# Altium schematic sheet Mosfet Driver.SchDoc
size A4; SheetNumber: 1; SheetTotal: 3
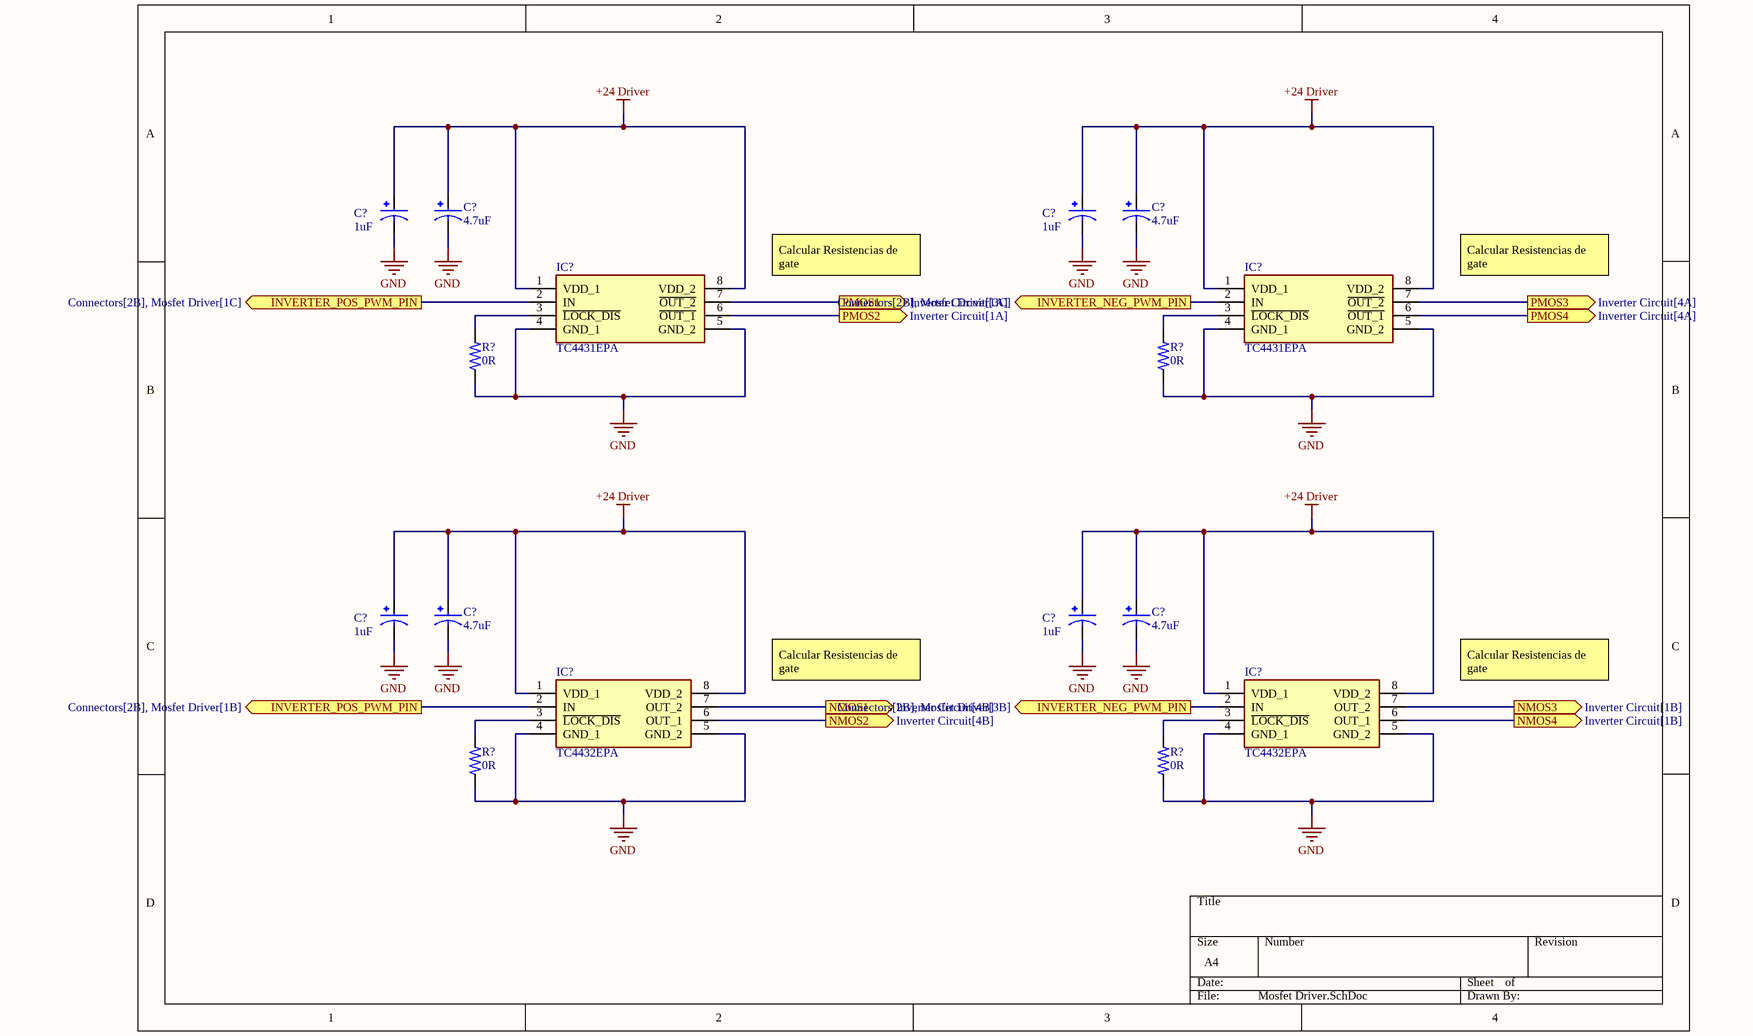
[diagram p0: Mosfet Driver.SchDoc]

## Parts
(Parts that share a designator on the sheet are numbered #1, #2 ... from top to bottom, then left to right.)
C?#1  1uF  [Electrolytic 4x5.4]
C?#2  4.7uF  [Electrolytic 4x5.4]
C?#3  1uF  [Electrolytic 4x5.4]
C?#4  4.7uF  [Electrolytic 4x5.4]
C?#5  1uF  [Electrolytic 4x5.4]
C?#6  4.7uF  [Electrolytic 4x5.4]
C?#7  1uF  [Electrolytic 4x5.4]
C?#8  4.7uF  [Electrolytic 4x5.4]
IC?#1  TC4431EPA  [DIP781W56P254L950H533Q8N]
IC?#2  TC4431EPA  [DIP781W56P254L950H533Q8N]
IC?#3  TC4432EPA  [DIP781W56P254L950H533Q8N]
IC?#4  TC4432EPA  [DIP781W56P254L950H533Q8N]
R?#1  0R  [0805]
R?#2  0R  [0805]
R?#3  0R  [0805]
R?#4  0R  [0805]

## Ports
INVERTER_NEG_PWM_PIN (out, see Connectors[2B], Mosfet Driver[3B]), INVERTER_NEG_PWM_PIN (out, see Connectors[2B], Mosfet Driver[3C]), INVERTER_POS_PWM_PIN (out, see Connectors[2B], Mosfet Driver[1B]), INVERTER_POS_PWM_PIN (out, see Connectors[2B], Mosfet Driver[1C]), NMOS1 (out, see Inverter Circuit[4B]), NMOS2 (out, see Inverter Circuit[4B]), NMOS3 (out, see Inverter Circuit[1B]), NMOS4 (out, see Inverter Circuit[1B]), PMOS1 (out, see Inverter Circuit[1A]), PMOS2 (out, see Inverter Circuit[1A]), PMOS3 (out, see Inverter Circuit[4A]), PMOS4 (out, see Inverter Circuit[4A])

## Nets
+24 Driver: C?#1.1 C?#2.1 C?#3.1 C?#4.1 C?#5.1 C?#6.1 C?#7.1 C?#8.1 IC?#1.1(VDD_1) IC?#1.8(VDD_2) IC?#2.1(VDD_1) IC?#2.8(VDD_2) IC?#3.1(VDD_1) IC?#3.8(VDD_2) IC?#4.1(VDD_1) IC?#4.8(VDD_2)
GND: C?#1.2 C?#2.2 C?#3.2 C?#4.2 C?#5.2 C?#6.2 C?#7.2 C?#8.2 IC?#1.4(GND_1) IC?#1.5(GND_2) IC?#2.4(GND_1) IC?#2.5(GND_2) IC?#3.4(GND_1) IC?#3.5(GND_2) IC?#4.4(GND_1) IC?#4.5(GND_2) R?#1.1 R?#2.1 R?#3.1 R?#4.1
INVERTER_NEG_PWM_PIN: IC?#2.2(IN) IC?#4.2(IN) ; port INVERTER_NEG_PWM_PIN
INVERTER_POS_PWM_PIN: IC?#1.2(IN) IC?#3.2(IN) ; port INVERTER_POS_PWM_PIN
NMOS1: IC?#3.7(OUT_2) ; port NMOS1
NMOS2: IC?#3.6(OUT_1) ; port NMOS2
NMOS3: IC?#4.7(OUT_2) ; port NMOS3
NMOS4: IC?#4.6(OUT_1) ; port NMOS4
PMOS1: IC?#1.7(~{OUT_2}) ; port PMOS1
PMOS2: IC?#1.6(~{OUT_1}) ; port PMOS2
PMOS3: IC?#2.7(~{OUT_2}) ; port PMOS3
PMOS4: IC?#2.6(~{OUT_1}) ; port PMOS4
NetIC?#1_3: IC?#1.3(~{LOCK_DIS}) R?#1.2
NetIC?#2_3: IC?#2.3(~{LOCK_DIS}) R?#2.2
NetIC?#3_3: IC?#3.3(~{LOCK_DIS}) R?#3.2
NetIC?#4_3: IC?#4.3(~{LOCK_DIS}) R?#4.2

## Notes on the sheet
- Calcular Resistencias de gate

## Library data of the parts
C?#1-C?#8 = Electrolytic 4x5.4: MF: Panasonic; MP: EEE-HA1E100WR; Package: RADIAL-2 Panasonic; Check_prices: https://www.snapeda.com/parts/EEE-HA1E100WR/Panasonic/view-part/778519/?ref=eda; Value: *; Price: None; Purchase-URL: https://pricing.snapeda.com/search/part/EEE-HA1E100WR/?ref=eda; SnapEDA_Link: https://www.snapeda.com/parts/EEE-HA1E100WR/Panasonic/view-part/778519/?ref=snap; Availability: In Stock
IC?#1 IC?#2 = TC4431EPA: Integrated Circuit; Manufacturer_Name: Microchip; Datasheet Link: http://www.microchip.com/mymicrochip/filehandler.aspx?ddocname=en011707; Height: 5.334mm; Manufacturer_Part_Number: TC4431EPA; Mouser Part Number: 579-TC4431EPA; Mouser Price/Stock: https://www.mouser.co.uk/ProductDetail/Microchip-Technology/TC4431EPA?qs=6NittM2kKvToa0NDydYeNA%3D%3D; Arrow Part Number: TC4431EPA; Arrow Price/Stock: https://www.arrow.com/en/products/tc4431epa/microchip-technology
IC?#3 IC?#4 = TC4432EPA: Integrated Circuit; Manufacturer_Name: Microchip; Datasheet Link: http://ww1.microchip.com/downloads/en/DeviceDoc/21424d.pdf; Height: 5.334mm; Manufacturer_Part_Number: TC4432EPA; Mouser Part Number: 579-TC4432EPA; Mouser Price/Stock: https://www.mouser.co.uk/ProductDetail/Microchip-Technology-Atmel/TC4432EPA?qs=EkZBwCRGcSv79fL5L3lP6g%3D%3D; Arrow Part Number: TC4432EPA; Arrow Price/Stock: https://www.arrow.com/en/products/tc4432epa/microchip-technology
R?#1-R?#4 = 0805_Resistor: Power_Rating: .25 W; MP: 2-2176053-0; Tolerance: 1%; Resistance: .33; MF: TE Connectivity; Price: None; Availability: In Stock; EU_RoHS_Compliance: Compliant with Exemptions; Package: 0805; Value: *; SnapEDA_Link: https://www.snapeda.com/parts/2-2176053-0/TE+Connectivity/view-part/?ref=snap; Check_prices: https://www.snapeda.com/parts/2-2176053-0/TE+Connectivity/view-part/?ref=eda